# EAGLE schematic Tractive System Active Light rev1 (EAGLE 9.5.2)
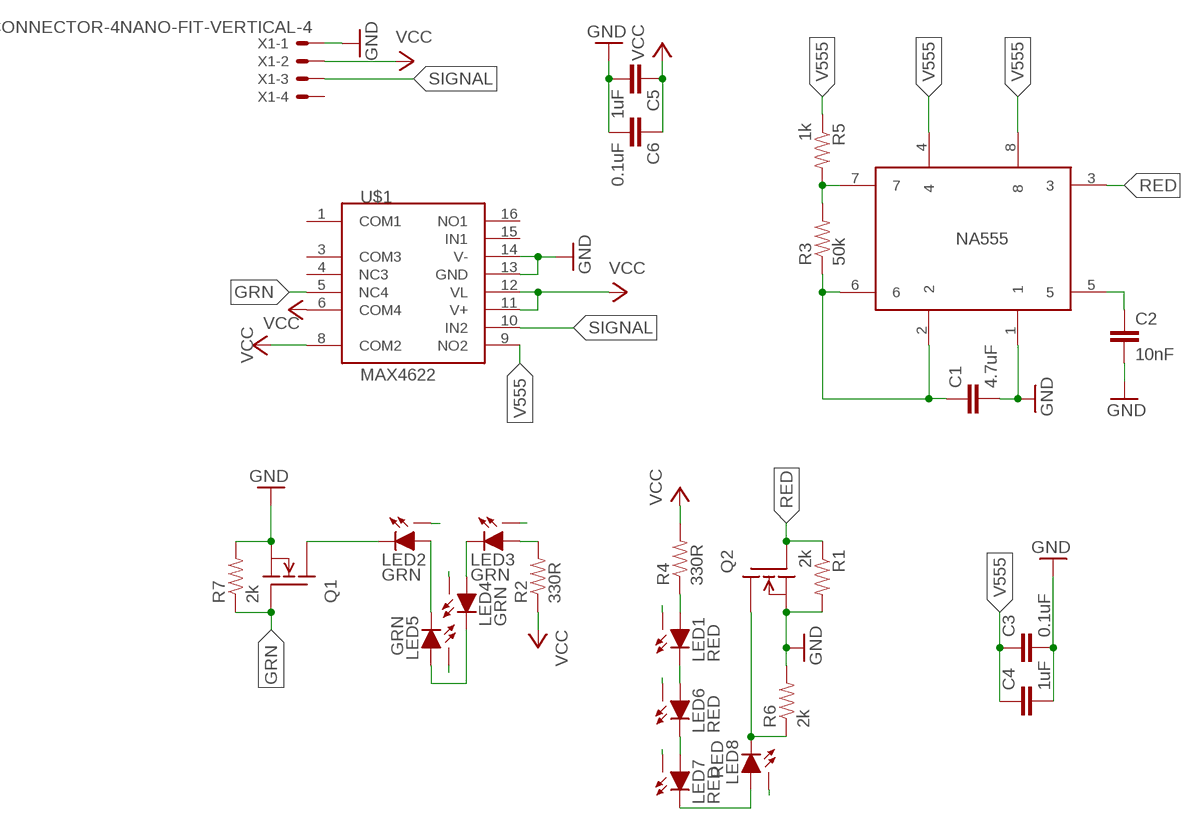
[diagram p0: schematic, sheet 1]

## Parts
C1  4.7uF  CAP0603-CAP  [0603-CAP]
C2  10nF  CAP0603-CAP  [0603-CAP]
C3  0.1uF  CAP0603-CAP  [0603-CAP]
C4  1uF  CAP0603-CAP  [0603-CAP]
C5  1uF  CAP0603-CAP  [0603-CAP]
C6  0.1uF  CAP0603-CAP  [0603-CAP]
LED1  RED  XP-E2XP-E2  [XP-E2]
LED2  GRN  XP-E2XP-E2  [XP-E2]
LED3  GRN  XP-E2XP-E2  [XP-E2]
LED4  GRN  XP-E2XP-E2  [XP-E2]
LED5  GRN  XP-E2XP-E2  [XP-E2]
LED6  RED  XP-E2XP-E2  [XP-E2]
LED7  RED  XP-E2XP-E2  [XP-E2]
LED8  RED  XP-E2XP-E2  [XP-E2]
NA555  NA555SO-8  [SOIC-08]
Q1  DMG3406LSOT  [SOT23]
Q2  DMG3406LSOT  [SOT23]
R1  2k  RESISTOR0603-RES  [0603-RES]
R2  330R  RESISTOR0603-RES  [0603-RES]
R3  50k  RESISTOR0603-RES  [0603-RES]
R4  330R  RESISTOR0603-RES  [0603-RES]
R5  1k  RESISTOR0603-RES  [0603-RES]
R6  2k  RESISTOR0603-RES  [0603-RES]
R7  2k  RESISTOR0603-RES  [0603-RES]
U$1  MAX4622  [SO16]
X1  CONNECTOR-4NANO-FIT-VERTICAL-4  [NANO-FIT_VERTICAL-4]

## Nets
GND: C1.2 C2.2 C3.2 C4.2 C5.2 C6.2 NA555.1 Q1.2(S) Q2.2(S) R1.2 R6.2 R7.2 U$1.13(GND) U$1.14(V-) X1.P$1
GRN: Q1.1(G) R7.1 U$1.5(NC4)
LED1_THERM: LED1.X
LED2_THERM: LED2.X
LED3_THERM: LED3.X
LED4_THERM: LED4.X
LED5_THERM: LED5.X
LED6_THERM: LED6.X
LED7_THERM: LED7.X
LED8_THERM: LED8.X
N$1: LED4.C LED5.A
N$2: LED2.C Q1.3(D)
N$3: LED3.C LED4.A
N$5: LED3.A R2.2
N$8: C1.1 NA555.2 NA555.6 R3.1
N$9: NA555.7 R3.2 R5.2
N$10: LED8.C Q2.3(D) R6.1
N$11: LED1.A R4.1
N$13: C2.1 NA555.5
N$16: LED2.A LED5.C
N$17: LED1.C LED6.A
N$18: LED6.C LED7.A
N$19: LED7.C LED8.A
RED: NA555.3 Q2.1(G) R1.1
SIGNAL: U$1.10(IN2) X1.P$3
V555: C3.1 C4.1 NA555.4 NA555.8 R5.1 U$1.9(NO2)
VCC: C5.1 C6.1 R2.1 R4.2 U$1.6(COM4) U$1.8(COM2) U$1.11(V+) U$1.12(VL) X1.P$2
Unconnected: U$1.1(COM1) U$1.3(COM3) U$1.4(NC3) U$1.15(IN1) U$1.16(NO1) X1.P$4

## Library data of the parts
C1-C6 = HyTechDevices:CAP: Capacitor Standard 0603 ceramic capacitor, and 0.1" leaded capacitor.; TOLERANCE: 5%; VOLTAGE: 25V
LED1-LED8 = HyTechDevices:XP-E2: XP-E2 high-brightness LED. Data sheet <https://www.cree.com/led-components/media/documents/XLampXPE2.pdf>
NA555 = HyTechDevices:NA555: Texas Instruments NA555 timer. Data sheet <http://www.ti.com/lit/ds/symlink/se555.pdf>
Q1 Q2 = HyTechDevices:DMG3406L: Generic NPN MOSFET DMG3406L (SOT-23, 2.8 A 30V)
R1-R7 = HyTechDevices:RESISTOR: Resistor Basic schematic elements and footprints for 0603, 1206, and PTH resistors.; TOLERANCE: 1%
U$1 = HyTechDevices:MAX4622: Maxim Integrated MAX 4622 analogue switch. Data sheet <https://datasheets.maximintegrated.com/en/ds/MAX4621-MAX4623.pdf>
X1 = HyTechDevices:CONNECTOR-4: Mini-Fit Junior connector 4 pole Source: http://www.molex.com